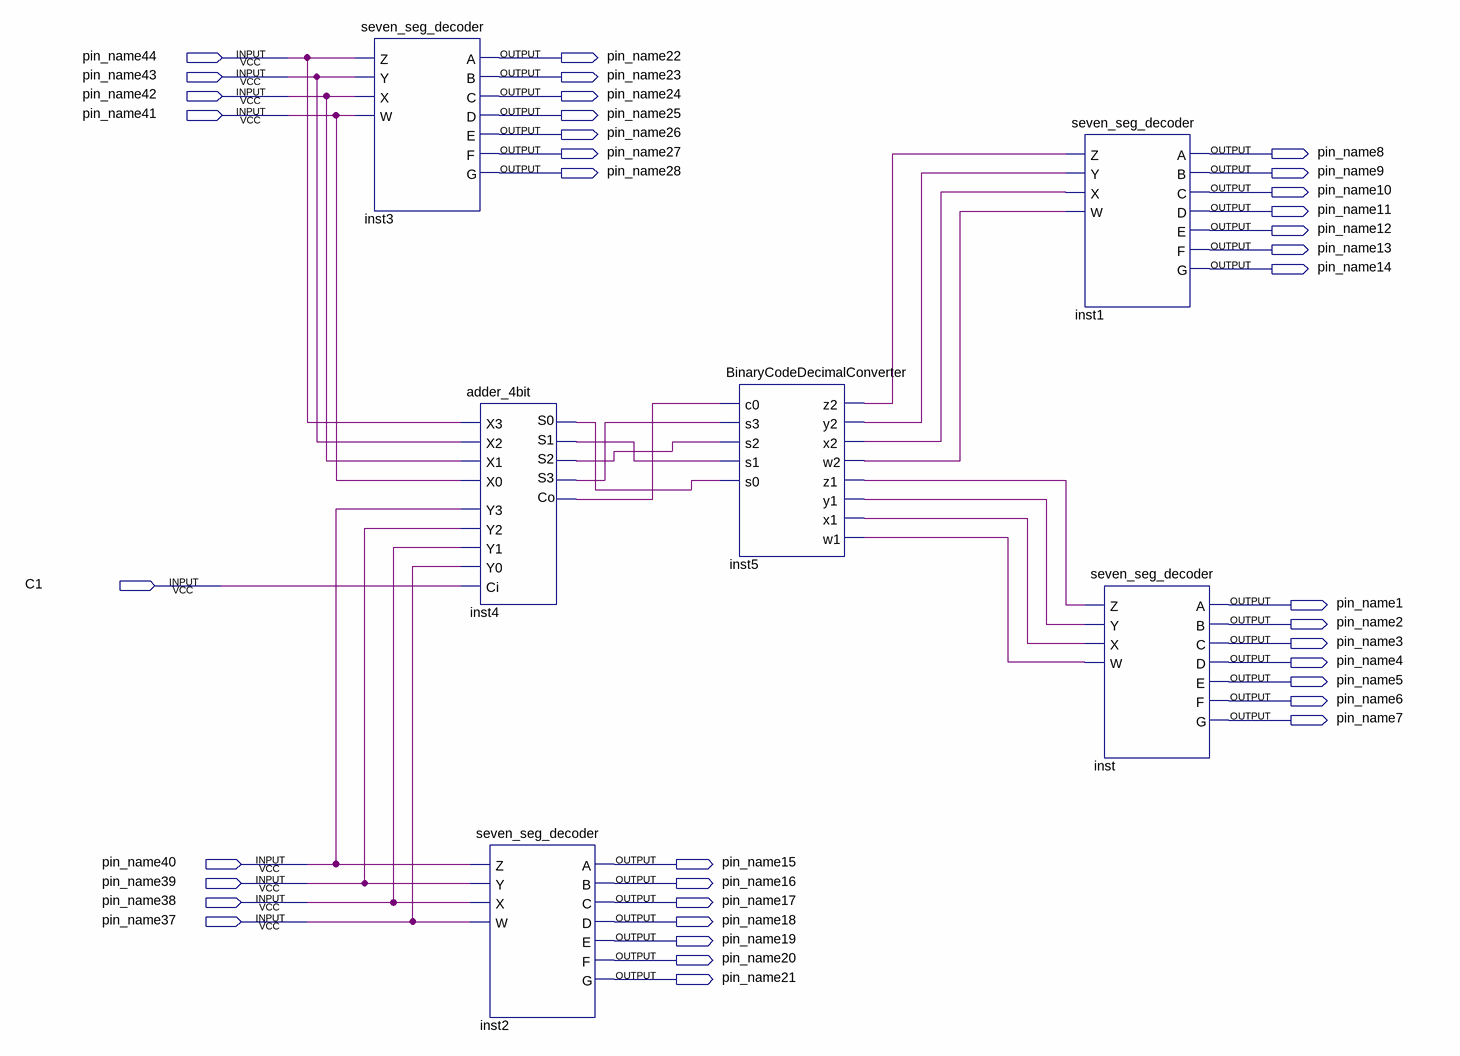
[diagram p0: schematic sheet]
// Quartus schematic lab6step1.bdf as structural Verilog: 6 symbols, 37 pins
module lab6step1 (
  input  pin_name44,
  input  pin_name43,
  input  pin_name42,
  input  pin_name41,
  input  C1,
  input  pin_name40,
  input  pin_name39,
  input  pin_name38,
  input  pin_name37,
  output pin_name22,
  output pin_name23,
  output pin_name24,
  output pin_name25,
  output pin_name26,
  output pin_name27,
  output pin_name8,
  output pin_name28,
  output pin_name9,
  output pin_name10,
  output pin_name11,
  output pin_name12,
  output pin_name13,
  output pin_name14,
  output pin_name1,
  output pin_name2,
  output pin_name3,
  output pin_name4,
  output pin_name5,
  output pin_name6,
  output pin_name7,
  output pin_name15,
  output pin_name16,
  output pin_name17,
  output pin_name18,
  output pin_name19,
  output pin_name20,
  output pin_name21
);

  wire inst4_co, inst4_s0, inst4_s1, inst4_s2, inst4_s3, inst5_w1, inst5_w2, inst5_x1, inst5_x2, inst5_y1,
       inst5_y2, inst5_z1, inst5_z2;

  seven_seg_decoder inst3 (
    .Z(pin_name44), .Y(pin_name43), .X(pin_name42), .W(pin_name41), .A(pin_name22), .B(pin_name23),
    .C(pin_name24), .D(pin_name25), .E(pin_name26), .F(pin_name27), .G(pin_name28));
  adder_4bit inst4 (
    .X3(pin_name44), .Y3(pin_name40), .X2(pin_name43), .Y2(pin_name39), .X1(pin_name42), .Y1(pin_name38),
    .X0(pin_name41), .Y0(pin_name37), .Ci(C1), .S0(inst4_s0), .S1(inst4_s1), .S2(inst4_s2), .S3(inst4_s3),
    .Co(inst4_co));
  seven_seg_decoder inst2 (
    .Z(pin_name40), .Y(pin_name39), .X(pin_name38), .W(pin_name37), .A(pin_name15), .B(pin_name16),
    .C(pin_name17), .D(pin_name18), .E(pin_name19), .F(pin_name20), .G(pin_name21));
  BinaryCodeDecimalConverter inst5 (
    .c0(inst4_co), .s3(inst4_s3), .s2(inst4_s2), .s1(inst4_s1), .s0(inst4_s0), .z2(inst5_z2), .y2(inst5_y2),
    .x2(inst5_x2), .w2(inst5_w2), .z1(inst5_z1), .y1(inst5_y1), .x1(inst5_x1), .w1(inst5_w1));
  seven_seg_decoder inst1 (
    .Z(inst5_z2), .Y(inst5_y2), .X(inst5_x2), .W(inst5_w2), .A(pin_name8), .B(pin_name9), .C(pin_name10),
    .D(pin_name11), .E(pin_name12), .F(pin_name13), .G(pin_name14));
  seven_seg_decoder inst (
    .Z(inst5_z1), .Y(inst5_y1), .X(inst5_x1), .W(inst5_w1), .A(pin_name1), .B(pin_name2), .C(pin_name3),
    .D(pin_name4), .E(pin_name5), .F(pin_name6), .G(pin_name7));
endmodule
